# Altium schematic sheet RAMConnection.SchDoc
size A4; SheetNumber: 2; SheetTotal: 6
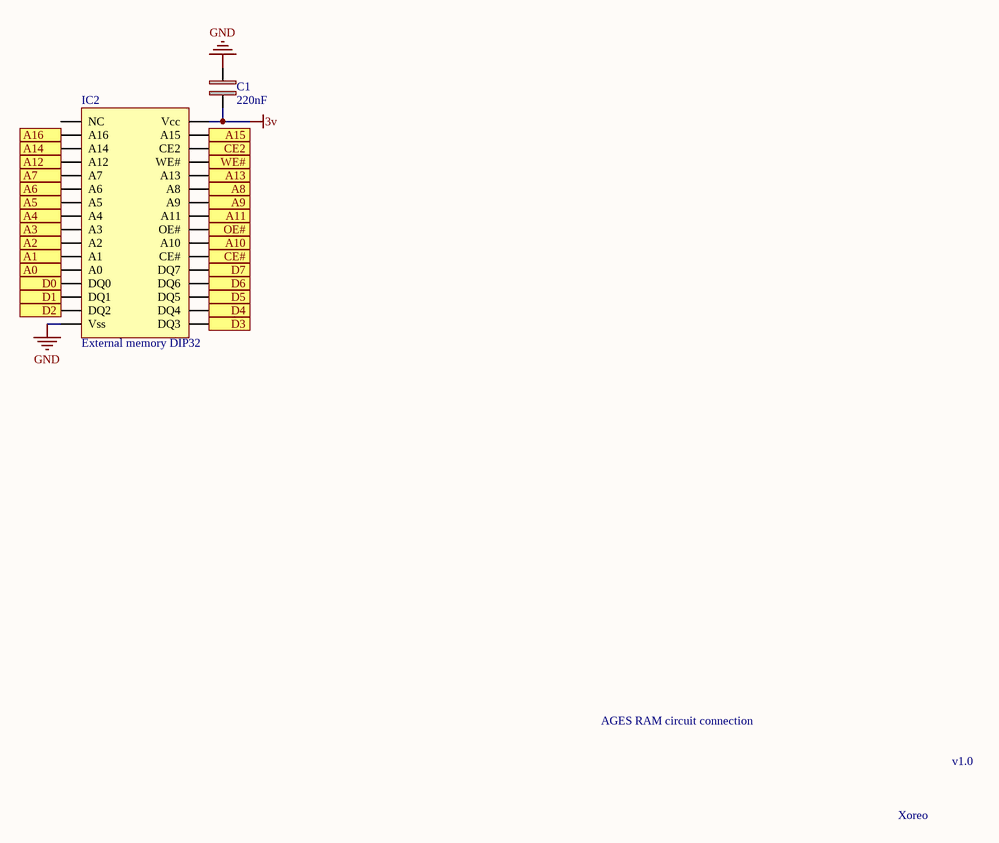
[diagram p0: RAMConnection.SchDoc]

## Parts
C1  220nF  [C0805C224K5RACTU]
IC2  External memory DIP32  [DIP32 HDR]

## Ports
A0, A1, A2, A3, A4, A5, A6, A7, A8, A9, A10, A11, A12, A13, A14, A15, A16, CE2, CE#, D0, D1, D2, D3, D4, D5, D6, D7, OE#, WE#

## Nets
3v: C1.2 IC2.32(Vcc)
GND: C1.1 IC2.16(Vss)
A0: IC2.12(A0) ; port A0
A1: IC2.11(A1) ; port A1
A2: IC2.10(A2) ; port A2
A3: IC2.9(A3) ; port A3
A4: IC2.8(A4) ; port A4
A5: IC2.7(A5) ; port A5
A6: IC2.6(A6) ; port A6
A7: IC2.5(A7) ; port A7
A8: IC2.27(A8) ; port A8
A9: IC2.26(A9) ; port A9
A10: IC2.23(A10) ; port A10
A11: IC2.25(A11) ; port A11
A12: IC2.4(A12) ; port A12
A13: IC2.28(A13) ; port A13
A14: IC2.3(A14) ; port A14
A15: IC2.31(A15) ; port A15
A16: IC2.2(A16) ; port A16
CE2: IC2.30(CE2) ; port CE2
CE#: IC2.22(CE#) ; port CE#
D0: IC2.13(DQ0) ; port D0
D1: IC2.14(DQ1) ; port D1
D2: IC2.15(DQ2) ; port D2
D3: IC2.17(DQ3) ; port D3
D4: IC2.18(DQ4) ; port D4
D5: IC2.19(DQ5) ; port D5
D6: IC2.20(DQ6) ; port D6
D7: IC2.21(DQ7) ; port D7
OE#: IC2.24(OE#) ; port OE#
WE#: IC2.29(WE#) ; port WE#

Not connected (* = marked no-connect by the designer): IC2 1(NC)

## Notes on the sheet
- AGES RAM circuit connection
- v1.0
- Xoreo

## Library data of the parts
C1 = Capacitor: 0.22µF: 0805 C 220nF Ceramic Multilayer Capacitor; 50 VDC; +125degC; X7R Dielec; +/-10%; Manufacturer: KEMET; Voltage Rating: 50V; Tolerance: 10%; Dissipation Factor: 2.5%; Supplier 1: RSComponents; Manufacturer Part Number: C0805C224K5RACTU; RoHS: Yes; Category: Ceramic Capacitors; Stock 1: 18500; Pricing 1: 500=0,04800, 2500=0,03900 (USD); Mount: Surface Mount,PCB; Case/Package: 0805; Case Code (Metric): 2012; Case Code (Imperial): 0805; Dielectric Material: Ceramic; Min Operating Temperature: -55°C; Max Operating Temperature: 125°C; Package Quantity: 1; Capacitance: 220nF; Packaging: Tape and Reel; Voltage Rating (DC): 50V; Dielectric: X7R; Termination: SMD/SMT; Voltage: 50V; Series: C; Construction: Flat; Length: 2mm; Width: 0.049inch; Height: 1.1mm; Thickness: 0.055inch; Lead Pitch: 0.75mm; Depth: 1.25mm; Radiation Hardening: No; REACH SVHC: No SVHC; RoHS Compliant: Yes; ComponentLink1URL: https://datasheet.ciiva.com/7842/kem-c1002-x7r-smd-7842582.pdf?src-supplier=Element14; ComponentLink1Description: https://datasheet.ciiva.com/7842/kem-c1002-x7r-smd-7842582.pdf?src-supplier=Element14; ComponentLink2URL: https://datasheet.ciiva.com/18193/getdatasheetpartid-304413-18193686.pdf?src-supplier=Verical; ComponentLink2Description: https://datasheet.ciiva.com/18193/getdatasheetpartid-304413-18193686.pdf?src-supplier=Verical; Supplier Part Number 1: 8029927
IC2 = IC: AS6C1008: AS6C1008 Series 1-Mbit (128 K x 8) 3 V 55 ns CMOS Static RAM - PDIP-32; Manufacturer: Alliance Memory; Manufacturer Part Number: AS6C1008-55PCN; Access Time: 55ns; Max Supply Voltage: 5.5V; Min Supply Voltage: 2.7V; Interface: Parallel; Memory Size: 1Mb; Memory Type: RAM,SRAM - Asynchronous,SDR; Operating Supply Voltage: 3V; Address Bus Width: 17b; Number of Ports: 1; Number of Words: 128000; Max Supply Current: 60mA; Supplier 1: Rs; RoHS: Yes; Category: RAM; Stock 1: 774; Pricing 1: 1=4,11000, 5=3,49000, 10=3,39000, 25=3,28000, 50=3,20000 (EUR); Mount: Through Hole; Case/Package: PDIP; Number of Pins: 32; Weight: 0.078125oz; Min Operating Temperature: 0°C; Max Operating Temperature: 70°C; Packaging: Rail/Tube; Package Quantity: 13; Series: AS6C1008; Density: 1Mb; Access Time-Max: 55ns; Supply Voltage-Nom: 3V; Length: 41.91mm; Width: 13.818mm; Height: 3.81mm; Radiation Hardening: No; RoHS Compliant: Yes; Lead Free: Lead Free; Temperature Grade: COMMERCIAL; Reach SVHC Compliant: Yes; ComponentLink1URL: https://datasheet.ciiva.com/19457/1927457-19457052.pdf?src-supplier=Jameco; ComponentLink1Description: https://datasheet.ciiva.com/19457/1927457-19457052.pdf?src-supplier=Jameco; ComponentLink2URL: https://datasheet.ciiva.com/6877/32783-6877594.pdf?src-supplier=Newark; ComponentLink2Description: https://datasheet.ciiva.com/6877/32783-6877594.pdf?src-supplier=Newark; ComponentLink3URL: https://datasheet.ciiva.com/18617/as6c1008feb2007-18617960.pdf?src-supplier=Digi-Key; ComponentLink3Description: https://datasheet.ciiva.com/18617/as6c1008feb2007-18617960.pdf?src-supplier=Digi-Key; ComponentLink4URL: https://datasheet.ciiva.com/1510/32783-1510620.pdf?src-supplier=Element14; ComponentLink4Description: https://datasheet.ciiva.com/1510/32783-1510620.pdf?src-supplier=Element14; ComponentLink5URL: https://datasheet.ciiva.com/3201/as6c1008feb2007-3201030.pdf?src-supplier=Avnet; ComponentLink5Description: https://datasheet.ciiva.com/3201/as6c1008feb2007-3201030.pdf?src-supplier=Avnet; ComponentLink6URL: https://datasheet.ciiva.com/16208/as6c1008feb2007-16208749.pdf?src-supplier=Future+Electronics; ComponentLink6Description: https://datasheet.ciiva.com/16208/as6c1008feb2007-16208749.pdf?src-supplier=Future+Electronics; Supplier Part Number 1: 7444542